# EAGLE schematic Thermostat (EAGLE 6.3)
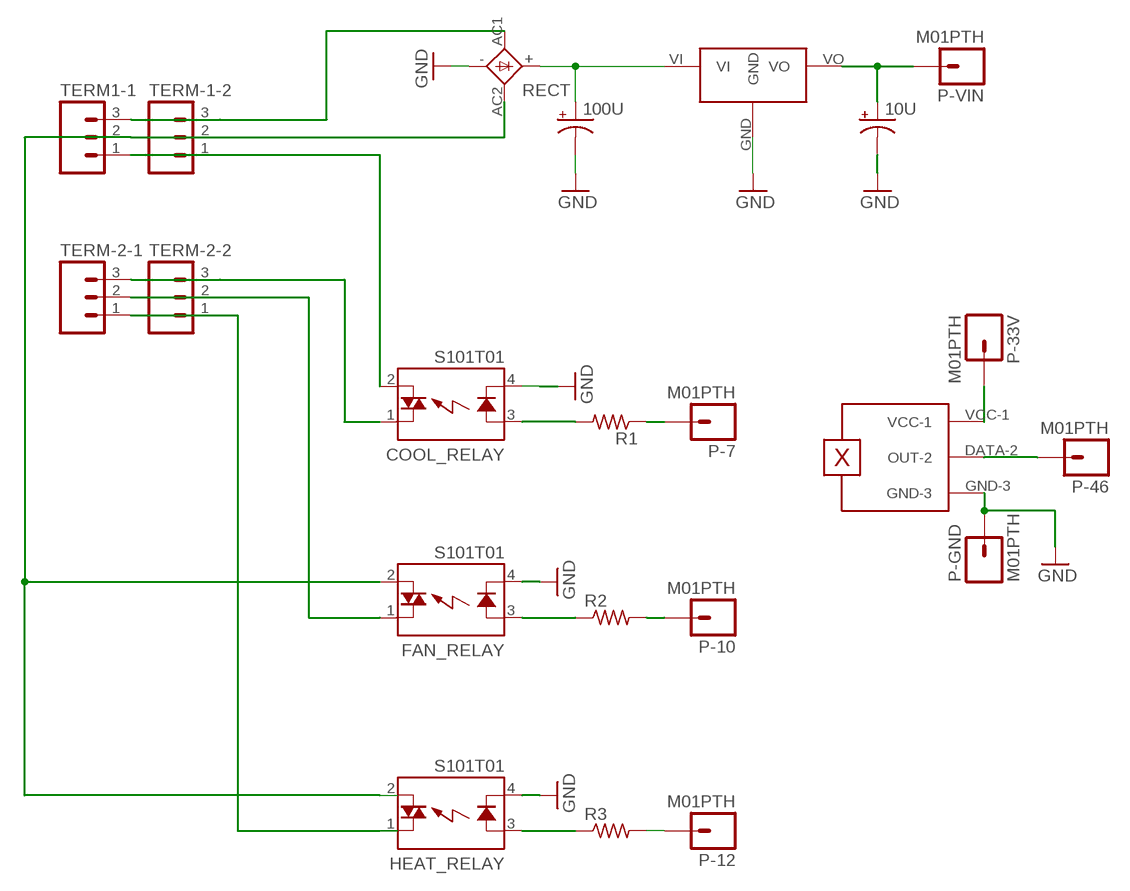
[diagram p0: schematic, sheet 1]

## Parts
10U  CAP_POLPTH2  [CPOL-RADIAL-10UF-25V]
100U  CAP_POLPTH1  [CPOL-RADIAL-100UF-25V]
COOL_RELAY  S101T01  [S102T0X]
FAN_RELAY  S101T01  [S102T0X]
HEAT_RELAY  S101T01  [S102T0X]
P-7  M01PTH  [1X01]
P-10  M01PTH  [1X01]
P-12  M01PTH  [1X01]
P-33V  M01PTH  [1X01]
P-46  M01PTH  [1X01]
P-GND  M01PTH  [1X01]
P-VIN  M01PTH  [1X01]
R1  R-US_0204/2V  [0204V]
R2  R-US_0204/2V  [0204V]
R3  R-US_0204/2V  [0204V]
RECT  GBU4  [GBU4S]
TERM1-1  M031X03_NO_SILK  [1X03_NO_SILK]
TERM-1-2  M031X03_NO_SILK  [1X03_NO_SILK]
TERM-2-1  M031X03_NO_SILK  [1X03_NO_SILK]
TERM-2-2  M031X03_NO_SILK  [1X03_NO_SILK]
U$1  TMP36  [TMP36]
U$2  V715W-500R  [SWITCHINGREGULATOR]

## Nets
GND: 10U.2(-) 100U.2(-) COOL_RELAY.4(K) FAN_RELAY.4(K) HEAT_RELAY.4(K) P-GND.1 RECT.- U$1.GND-3 U$2.GND
N$1: COOL_RELAY.2(DS2) TERM1-1.1 TERM-1-2.1
N$2: HEAT_RELAY.3(A) R3.1
N$3: RECT.AC1(AC2) TERM1-1.3 TERM-1-2.3
N$4: P-7.1 R1.1
N$5: P-46.1 U$1.DATA-2(OUT-2)
N$6: FAN_RELAY.3(A) R2.1
N$7: P-10.1 R2.2
N$8: P-12.1 R3.2
N$9: COOL_RELAY.3(A) R1.2
N$10: 10U.1(+) P-VIN.1 U$2.VO
N$11: P-33V.1 U$1.VCC-1
N$12: 100U.1(+) RECT.+ U$2.VI
N$13: HEAT_RELAY.1(DS1) TERM-2-1.1 TERM-2-2.1
N$14: COOL_RELAY.1(DS1) TERM-2-1.3 TERM-2-2.3
N$15: FAN_RELAY.1(DS1) TERM-2-1.2 TERM-2-2.2
P2: FAN_RELAY.2(DS2) HEAT_RELAY.2(DS2) RECT.AC2(AC1) TERM1-1.2 TERM-1-2.2

## Library data of the parts
10U 100U = SparkFun-Passives:CAP_POL: Capacitor Polarized These are standard SMD and PTH capacitors. Normally 10uF, 47uF, and 100uF in electrolytic and tantalum varieties. Always verify the external diameter of the through hole cap, it varies with capacity, voltage, and manufacturer. The EIA devices should be standard.
COOL_RELAY FAN_RELAY HEAT_RELAY = relay:S?*: Low Height Type Solid State Relays SHARP Source: 162574-da-01-en-S202T02_Solid_State_Relais.pdf Source: http://sharp-world.com .. s102s11_e.pdf; OC_FARNELL: unknown; OC_NEWARK: unknown
P-7 P-10 P-12 P-33V P-46 P-GND P-VIN = SparkFun-Connectors:M01: Header 1 Standard 1-pin 0.1" header. Use with straight break away headers (SKU : PRT-00116), right angle break away headers (PRT-00553), swiss pins (PRT-00743), machine pins (PRT-00117), and female headers (PRT-00115).
R1-R3 = resistor:R-US_: RESISTOR, American symbol
RECT = rectifier:GBU4: GENERAL INSTRUMENT RECTIFIER
TERM1-1 TERM-1-2 TERM-2-1 TERM-2-2 = SparkFun-Connectors:M03: Header 3 Standard 3-pin 0.1" header. Use with straight break away headers (SKU : PRT-00116), right angle break away headers (PRT-00553), swiss pins (PRT-00743), machine pins (PRT-00117), and female headers (PRT-00115). Molex polarized connector foot print use with SKU : PRT-08232 with associated crimp pins and housings.
U$1 = android-thermostat:TMP36
U$2 = android-thermostat:V715W-500R